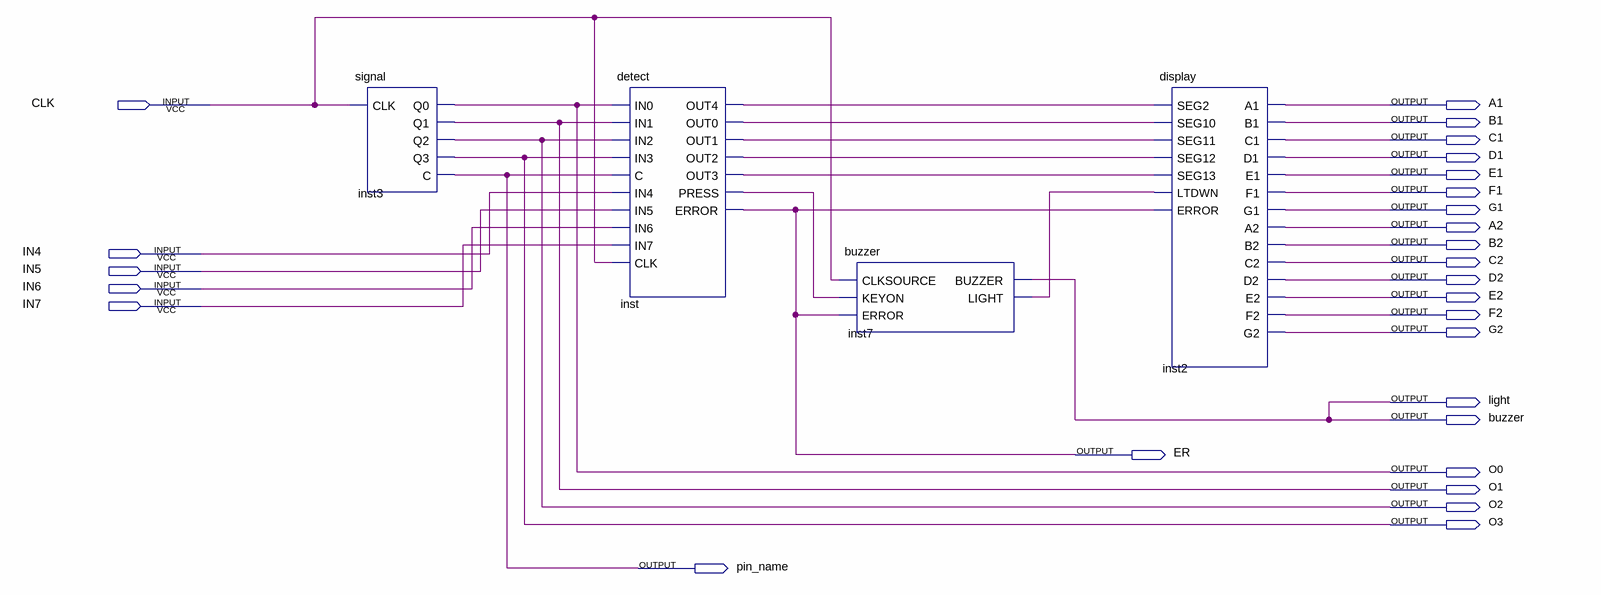
[diagram p0: schematic sheet]
// Quartus schematic cnchensh.bdf as structural Verilog: 4 symbols, 27 pins
module cnchensh (
  input  CLK,
  input  IN4,
  input  IN5,
  input  IN6,
  input  IN7,
  output A1,
  output B1,
  output C1,
  output D1,
  output E1,
  output F1,
  output G1,
  output A2,
  output B2,
  output C2,
  output D2,
  output E2,
  output F2,
  output G2,
  output light,
  output buzzer,
  output ER,
  output O0,
  output O1,
  output O2,
  output O3,
  output pin_name
);

  wire inst7_light, inst_out0, inst_out1, inst_out2, inst_out3, inst_out4, inst_press;

  signal inst3 (.CLK(CLK), .Q0(O0), .Q1(O1), .Q2(O2), .Q3(O3), .C(pin_name));
  detect inst (
    .IN0(O0), .IN1(O1), .IN2(O2), .IN3(O3), .C(pin_name), .IN4(IN4), .IN5(IN5), .IN6(IN6), .IN7(IN7),
    .CLK(CLK), .OUT4(inst_out4), .OUT0(inst_out0), .OUT1(inst_out1), .OUT2(inst_out2), .OUT3(inst_out3),
    .PRESS(inst_press), .ERROR(ER));
  buzzer inst7 (.CLKSOURCE(CLK), .KEYON(inst_press), .ERROR(ER), .BUZZER(buzzer), .LIGHT(inst7_light));
  display inst2 (
    .SEG2(inst_out4), .SEG10(inst_out0), .SEG11(inst_out1), .SEG12(inst_out2), .SEG13(inst_out3),
    .LTDWN(inst7_light), .ERROR(ER), .A1(A1), .B1(B1), .C1(C1), .D1(D1), .E1(E1), .F1(F1), .G1(G1), .A2(A2),
    .B2(B2), .C2(C2), .D2(D2), .E2(E2), .F2(F2), .G2(G2));

  assign light = buzzer;
endmodule
